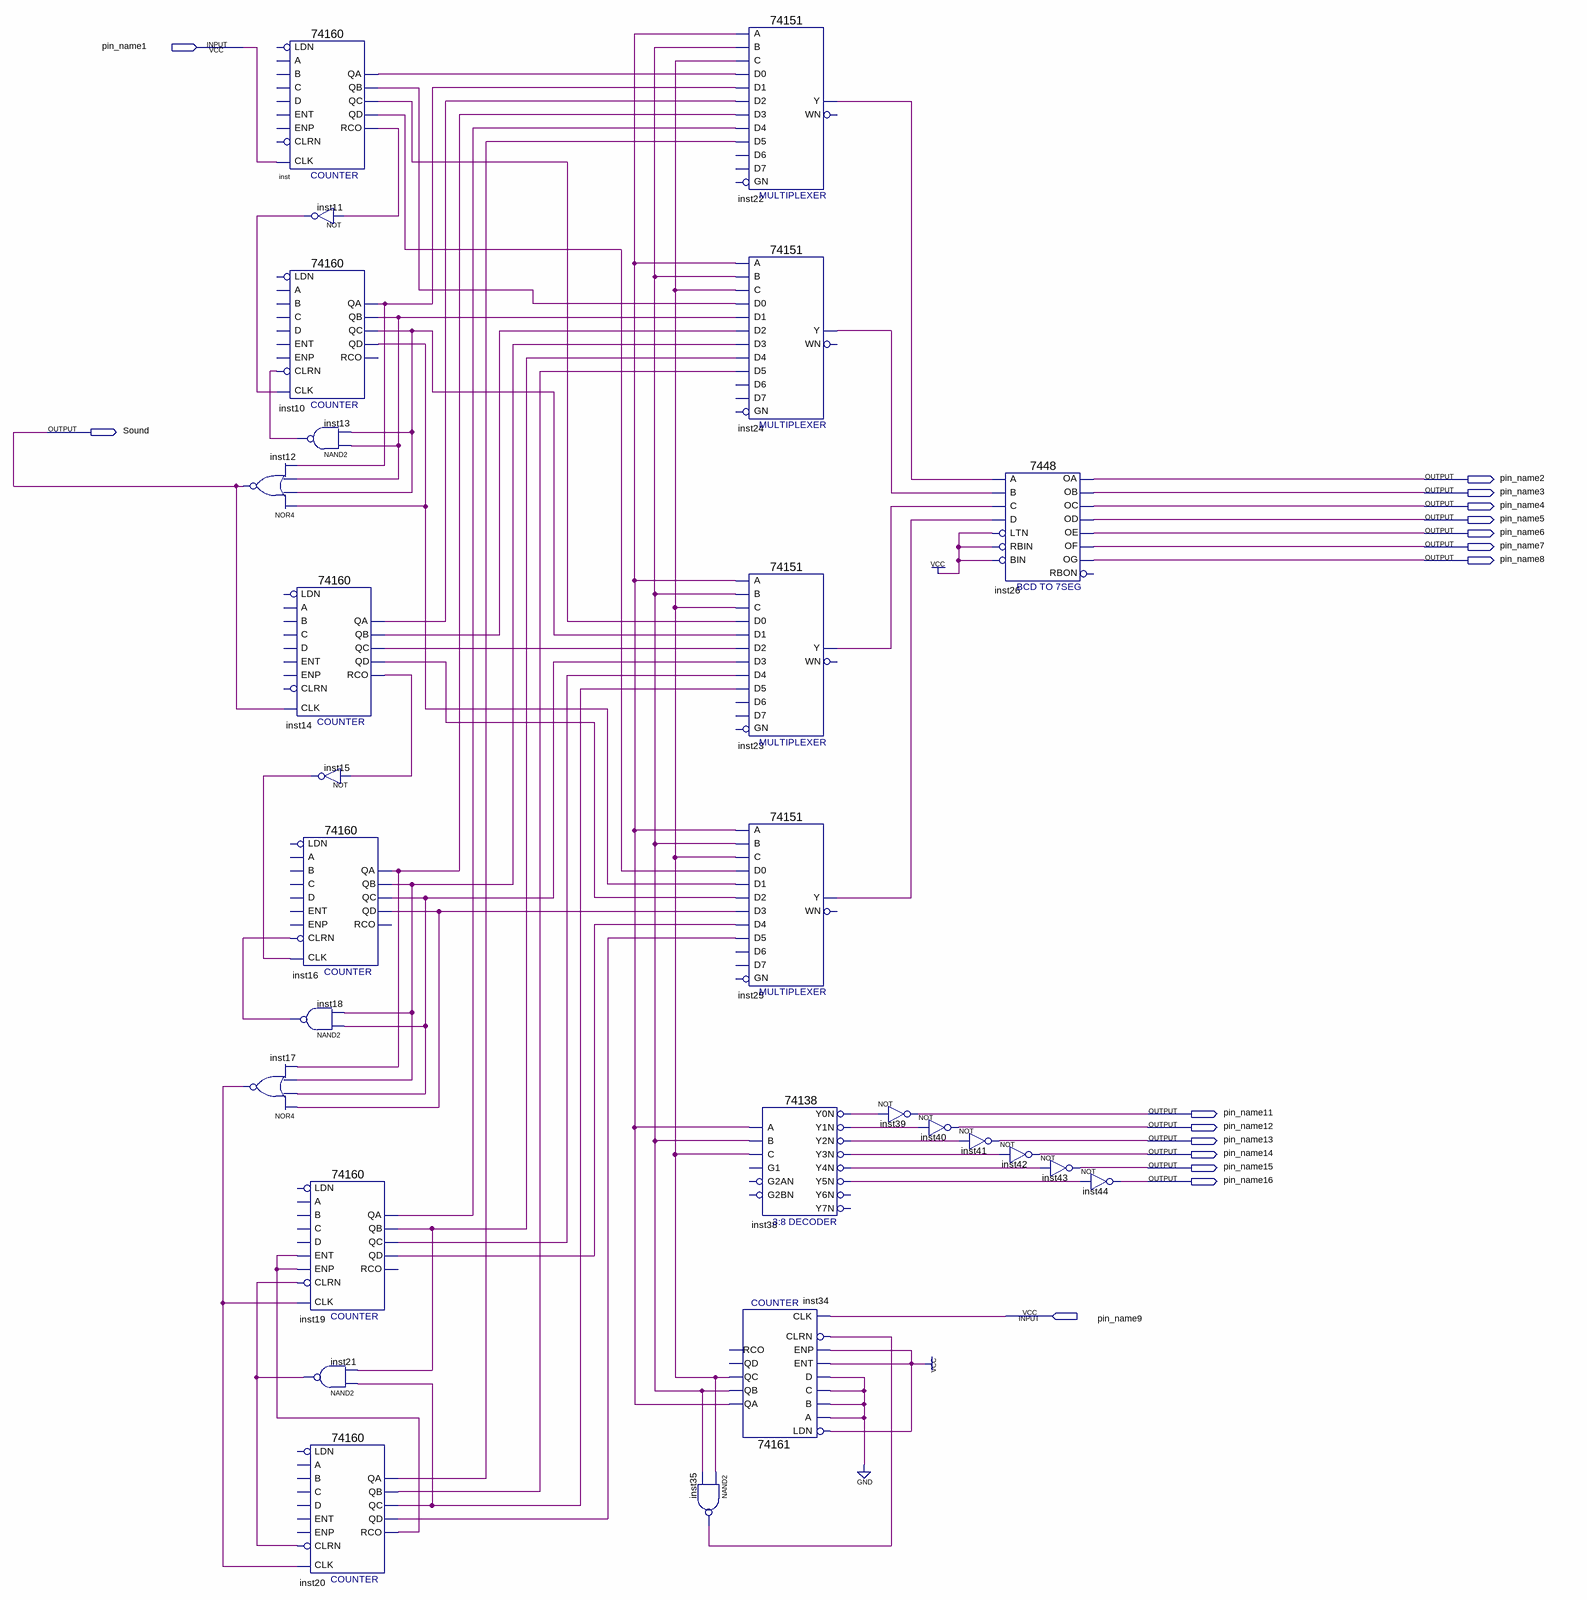
[diagram p0: schematic sheet]
// Quartus schematic clock.bdf as structural Verilog: 27 symbols, 16 pins
module clock (
  input  pin_name1,
  input  pin_name9,
  output Sound,
  output pin_name2,
  output pin_name3,
  output pin_name4,
  output pin_name5,
  output pin_name6,
  output pin_name7,
  output pin_name8,
  output pin_name11,
  output pin_name12,
  output pin_name13,
  output pin_name14,
  output pin_name15,
  output pin_name16
);

  wire inst10_qa, inst10_qb, inst10_qc, inst10_qd, inst11_out, inst13_out, inst14_qa, inst14_qb, inst14_qc,
       inst14_qd, inst14_rco, inst15_out, inst16_qa, inst16_qb, inst16_qc, inst16_qd, inst17_out, inst18_out,
       inst19_qa, inst19_qb, inst19_qc, inst19_qd, inst20_qa, inst20_qb, inst20_qc, inst20_qd, inst20_rco,
       inst21_out, inst22_y, inst23_y, inst24_y, inst25_y, inst34_qa, inst34_qb, inst34_qc, inst35_out,
       inst38_y0n, inst38_y1n, inst38_y2n, inst38_y3n, inst38_y4n, inst38_y5n, inst_qa, inst_qb, inst_qc,
       inst_qd, inst_rco;

  \74160  inst (
    .CLK(pin_name1), .QD(inst_qd), .QA(inst_qa), .QB(inst_qb), .QC(inst_qc), .RCO(inst_rco));  // open: ENT, A, B, C, D, LDN, ENP, CLRN
  \74160  inst10 (
    .CLK(inst11_out), .CLRN(inst13_out), .QD(inst10_qd), .QA(inst10_qa), .QB(inst10_qb), .QC(inst10_qc));  // open: ENT, A, B, C, D, LDN, ENP, RCO
  nor inst12 (Sound, inst10_qd, inst10_qc, inst10_qb, inst10_qa);
  \74160  inst14 (
    .CLK(Sound), .QD(inst14_qd), .QA(inst14_qa), .QB(inst14_qb), .QC(inst14_qc), .RCO(inst14_rco));  // open: ENT, A, B, C, D, LDN, ENP, CLRN
  \74160  inst16 (
    .CLK(inst15_out), .CLRN(inst18_out), .QD(inst16_qd), .QA(inst16_qa), .QB(inst16_qb), .QC(inst16_qc));  // open: ENT, A, B, C, D, LDN, ENP, RCO
  nand inst18 (inst18_out, inst16_qc, inst16_qb);
  nor inst17 (inst17_out, inst16_qd, inst16_qc, inst16_qb, inst16_qa);
  not inst11 (inst11_out, inst_rco);
  nand inst13 (inst13_out, inst10_qb, inst10_qc);
  not inst15 (inst15_out, inst14_rco);
  \74160  inst19 (
    .CLK(inst17_out), .ENT(inst20_rco), .ENP(inst20_rco), .CLRN(inst21_out), .QD(inst19_qd), .QA(inst19_qa),
    .QB(inst19_qb), .QC(inst19_qc));  // open: A, B, C, D, LDN, RCO
  nand inst21 (inst21_out, inst20_qc, inst19_qb);
  \74160  inst20 (
    .CLK(inst17_out), .CLRN(inst21_out), .QD(inst20_qd), .QA(inst20_qa), .QB(inst20_qb), .QC(inst20_qc),
    .RCO(inst20_rco));  // open: ENT, A, B, C, D, LDN, ENP
  nand inst35 (inst35_out, inst34_qc, inst34_qb);
  \74151  inst22 (
    .C(inst34_qc), .B(inst34_qb), .A(inst34_qa), .D5(inst20_qa), .D0(inst_qa), .D1(inst10_qa),
    .D4(inst19_qa), .D3(inst16_qa), .D2(inst14_qa), .Y(inst22_y));  // open: GN, D6, D7, WN
  \74151  inst24 (
    .C(inst34_qc), .B(inst34_qb), .A(inst34_qa), .D5(inst20_qb), .D0(inst_qb), .D1(inst10_qb),
    .D4(inst19_qb), .D3(inst16_qb), .D2(inst14_qb), .Y(inst24_y));  // open: GN, D6, D7, WN
  \74151  inst23 (
    .C(inst34_qc), .B(inst34_qb), .A(inst34_qa), .D5(inst20_qc), .D0(inst_qc), .D1(inst10_qc),
    .D4(inst19_qc), .D3(inst16_qc), .D2(inst14_qc), .Y(inst23_y));  // open: GN, D6, D7, WN
  \74151  inst25 (
    .C(inst34_qc), .B(inst34_qb), .A(inst34_qa), .D5(inst20_qd), .D0(inst_qd), .D1(inst10_qd),
    .D4(inst19_qd), .D3(inst16_qd), .D2(inst14_qd), .Y(inst25_y));  // open: GN, D6, D7, WN
  \74138  inst38 (
    .A(inst34_qa), .B(inst34_qb), .C(inst34_qc), .Y0N(inst38_y0n), .Y1N(inst38_y1n), .Y2N(inst38_y2n),
    .Y3N(inst38_y3n), .Y4N(inst38_y4n), .Y5N(inst38_y5n));  // open: G1, G2AN, G2BN, Y6N, Y7N
  \74161  inst34 (
    .CLRN(inst35_out), .CLK(pin_name9), .ENP(1'b1), .LDN(1'b1), .A(1'b0), .D(1'b0), .ENT(1'b1), .B(1'b0),
    .C(1'b0), .QC(inst34_qc), .QB(inst34_qb), .QA(inst34_qa));  // open: QD, RCO
  not inst39 (pin_name11, inst38_y0n);
  not inst40 (pin_name12, inst38_y1n);
  \7448  inst26 (
    .A(inst22_y), .C(inst23_y), .D(inst25_y), .B(inst24_y), .RBIN(1'b1), .BIN(1'b1), .LTN(1'b1),
    .OC(pin_name4), .OE(pin_name6), .OD(pin_name5), .OF(pin_name7), .OG(pin_name8), .OB(pin_name3),
    .OA(pin_name2));  // open: RBON
  not inst41 (pin_name13, inst38_y2n);
  not inst42 (pin_name14, inst38_y3n);
  not inst43 (pin_name15, inst38_y4n);
  not inst44 (pin_name16, inst38_y5n);
endmodule
